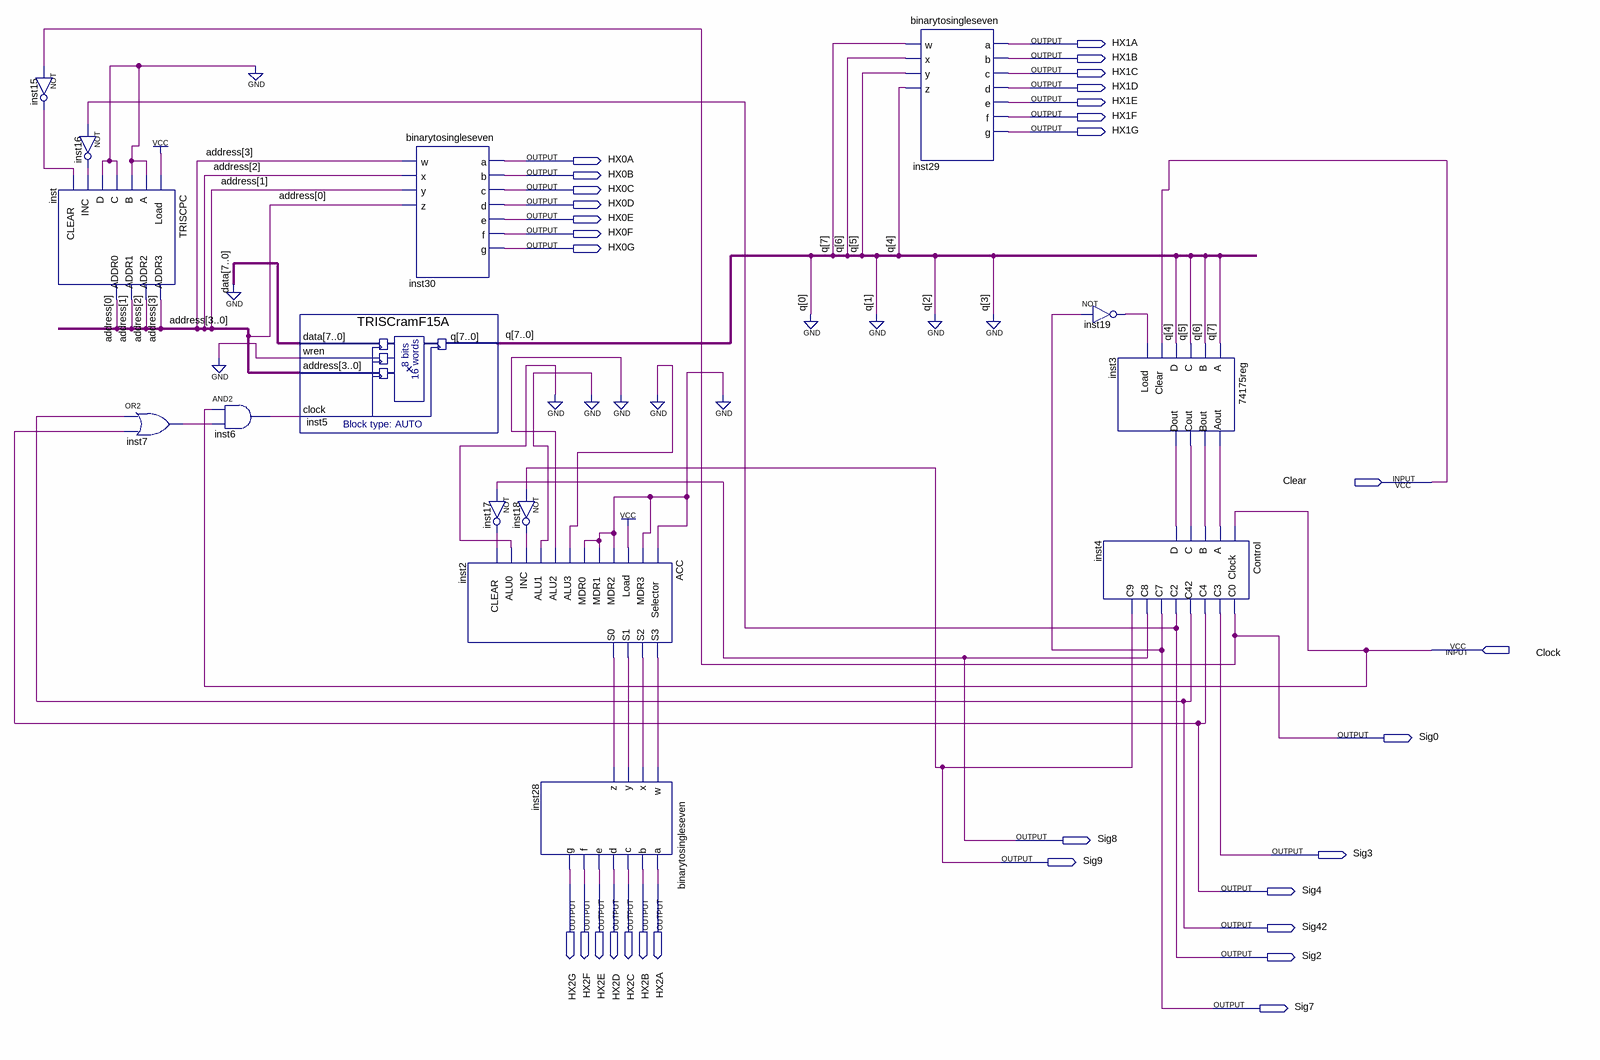
[diagram p0: schematic sheet]
// Quartus schematic TRISCA.bdf as structural Verilog: 15 symbols, 31 pins
module TRISCA (
  input  Clear,
  input  Clock,
  output HX1A,
  output HX1B,
  output HX1C,
  output HX1D,
  output HX1E,
  output HX1F,
  output HX1G,
  output HX0A,
  output HX0B,
  output HX0C,
  output HX0D,
  output HX0E,
  output HX0F,
  output HX0G,
  output Sig0,
  output Sig8,
  output Sig3,
  output Sig9,
  output HX2G,
  output HX2F,
  output HX2E,
  output HX2D,
  output HX2C,
  output HX2B,
  output HX2A,
  output Sig4,
  output Sig42,
  output Sig2,
  output Sig7
);

  wire inst2_s0, inst2_s1, inst2_s2, inst2_s3, inst3_aout, inst3_bout, inst3_cout, inst3_dout, inst6_out,
       inst7_out, inst15_out, inst16_out, inst17_out, inst18_out, inst19_out;
  wire [3:0] address;
  wire [7:0] q;

  not inst15 (inst15_out, Sig0);
  TRISCPC inst (
    .Load(1'b1), .A(1'b0), .B(1'b0), .C(1'b0), .D(1'b0), .INC(inst16_out), .CLEAR(inst15_out),
    .ADDR3(address[3]), .ADDR2(address[2]), .ADDR1(address[1]), .ADDR0(address[0]));
  not inst16 (inst16_out, Sig2);
  or inst7 (inst7_out, Sig42, Sig4);
  and inst6 (inst6_out, Clock, inst7_out);
  TRISCramF15A inst5 (.data({8{1'b0}}), .wren(1'b0), .address(address), .clock(inst6_out), .q(q));
  binarytosingleseven inst30 (
    .w(address[3]), .x(address[2]), .y(address[1]), .z(address[0]), .a(HX0A), .b(HX0B), .c(HX0C), .d(HX0D),
    .e(HX0E), .f(HX0F), .g(HX0G));
  ACC inst2 (
    .Selector(1'b0), .MDR3(1'b0), .Load(1'b1), .MDR2(1'b0), .MDR1(1'b0), .MDR0(1'b0), .ALU3(1'b0),
    .ALU2(1'b0), .ALU1(1'b0), .INC(inst18_out), .ALU0(1'b0), .CLEAR(inst17_out), .S3(inst2_s3),
    .S2(inst2_s2), .S1(inst2_s1), .S0(inst2_s0));
  not inst17 (inst17_out, Sig8);
  not inst18 (inst18_out, Sig9);
  binarytosingleseven inst28 (
    .w(inst2_s3), .x(inst2_s2), .y(inst2_s1), .z(inst2_s0), .a(HX2A), .b(HX2B), .c(HX2C), .d(HX2D), .e(HX2E),
    .f(HX2F), .g(HX2G));
  binarytosingleseven inst29 (
    .w(q[7]), .x(q[6]), .y(q[5]), .z(q[4]), .a(HX1A), .b(HX1B), .c(HX1C), .d(HX1D), .e(HX1E), .f(HX1F),
    .g(HX1G));
  not inst19 (inst19_out, Sig7);
  \74175reg  inst3 (
    .A(q[7]), .B(q[6]), .C(q[5]), .D(q[4]), .Clear(Clear), .Load(inst19_out), .Aout(inst3_aout),
    .Bout(inst3_bout), .Cout(inst3_cout), .Dout(inst3_dout));
  Control inst4 (
    .Clock(Clock), .A(inst3_aout), .B(inst3_bout), .C(inst3_cout), .D(inst3_dout), .C0(Sig0), .C3(Sig3),
    .C4(Sig4), .C42(Sig42), .C2(Sig2), .C7(Sig7), .C8(Sig8), .C9(Sig9));
  // also tied to GND on the sheet: {q[0], q[1], q[2], q[3]}
endmodule
